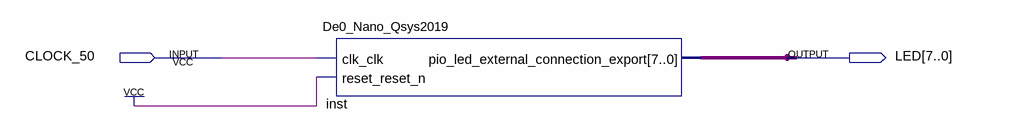
[diagram p0: schematic sheet]
// Quartus schematic First_Niosii.bdf as structural Verilog: 1 symbols, 2 pins
module First_Niosii (
  input  CLOCK_50,
  output [7:0] LED
);

  De0_Nano_Qsys2019 inst (.clk_clk(CLOCK_50), .reset_reset_n(1'b1), .pio_led_external_connection_export(LED));
endmodule
